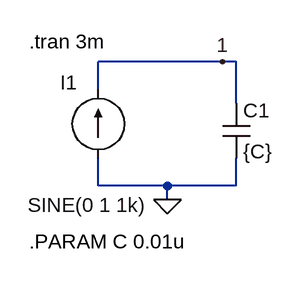
[diagram p0: schematic Fig_6-6_C-i-dt_SIN.asc]
Fig_6-6_C-i-dt_SIN.asc, the LTspice schematic file:
Version 4
SHEET 1 880 680
WIRE 256 80 112 80
WIRE 272 80 256 80
WIRE 112 112 112 80
WIRE 272 128 272 80
WIRE 112 224 112 192
WIRE 192 224 112 224
WIRE 272 224 272 192
WIRE 272 224 192 224
WIRE 192 240 192 224
FLAG 192 240 0
FLAG 256 80 1
SYMBOL cap 256 128 R0
SYMATTR InstName C1
SYMATTR Value {C}
SYMBOL current 112 192 R180
WINDOW 0 24 88 Left 2
WINDOW 3 -56 -54 Left 2
WINDOW 123 0 0 Left 2
WINDOW 39 0 0 Left 2
SYMATTR InstName I1
SYMATTR Value SINE(0 1 1k)
TEXT 32 56 Left 2 !.tran 3m
TEXT 32 288 Left 2 !.PARAM C 0.01u

The netlist it stands for:
* Fig_6-6_C-i-dt_SIN.asc
C1 1 0 {C}
I1 0 1 SINE(0 1 1k)
.tran 3m
.PARAM C 0.01u
.backanno
.end